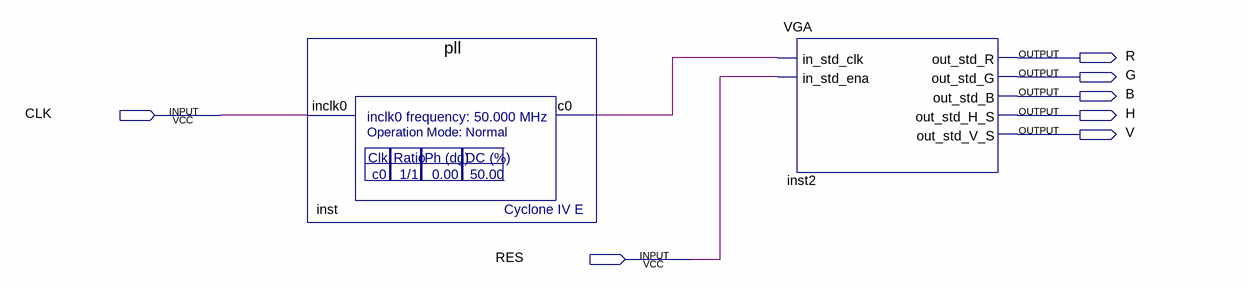
[diagram p0: schematic sheet]
// Quartus schematic top_vga.bdf as structural Verilog: 2 symbols, 7 pins
module top_vga (
  input  CLK,
  input  RES,
  output R,
  output G,
  output B,
  output H,
  output V
);

  wire inst_c0;

  pll inst (.inclk0(CLK), .c0(inst_c0));
  VGA inst2 (
    .in_std_clk(inst_c0), .in_std_ena(RES), .out_std_R(R), .out_std_G(G), .out_std_B(B), .out_std_H_S(H),
    .out_std_V_S(V));
endmodule
